# EAGLE schematic Counter2DigitRG (EAGLE 6.4)
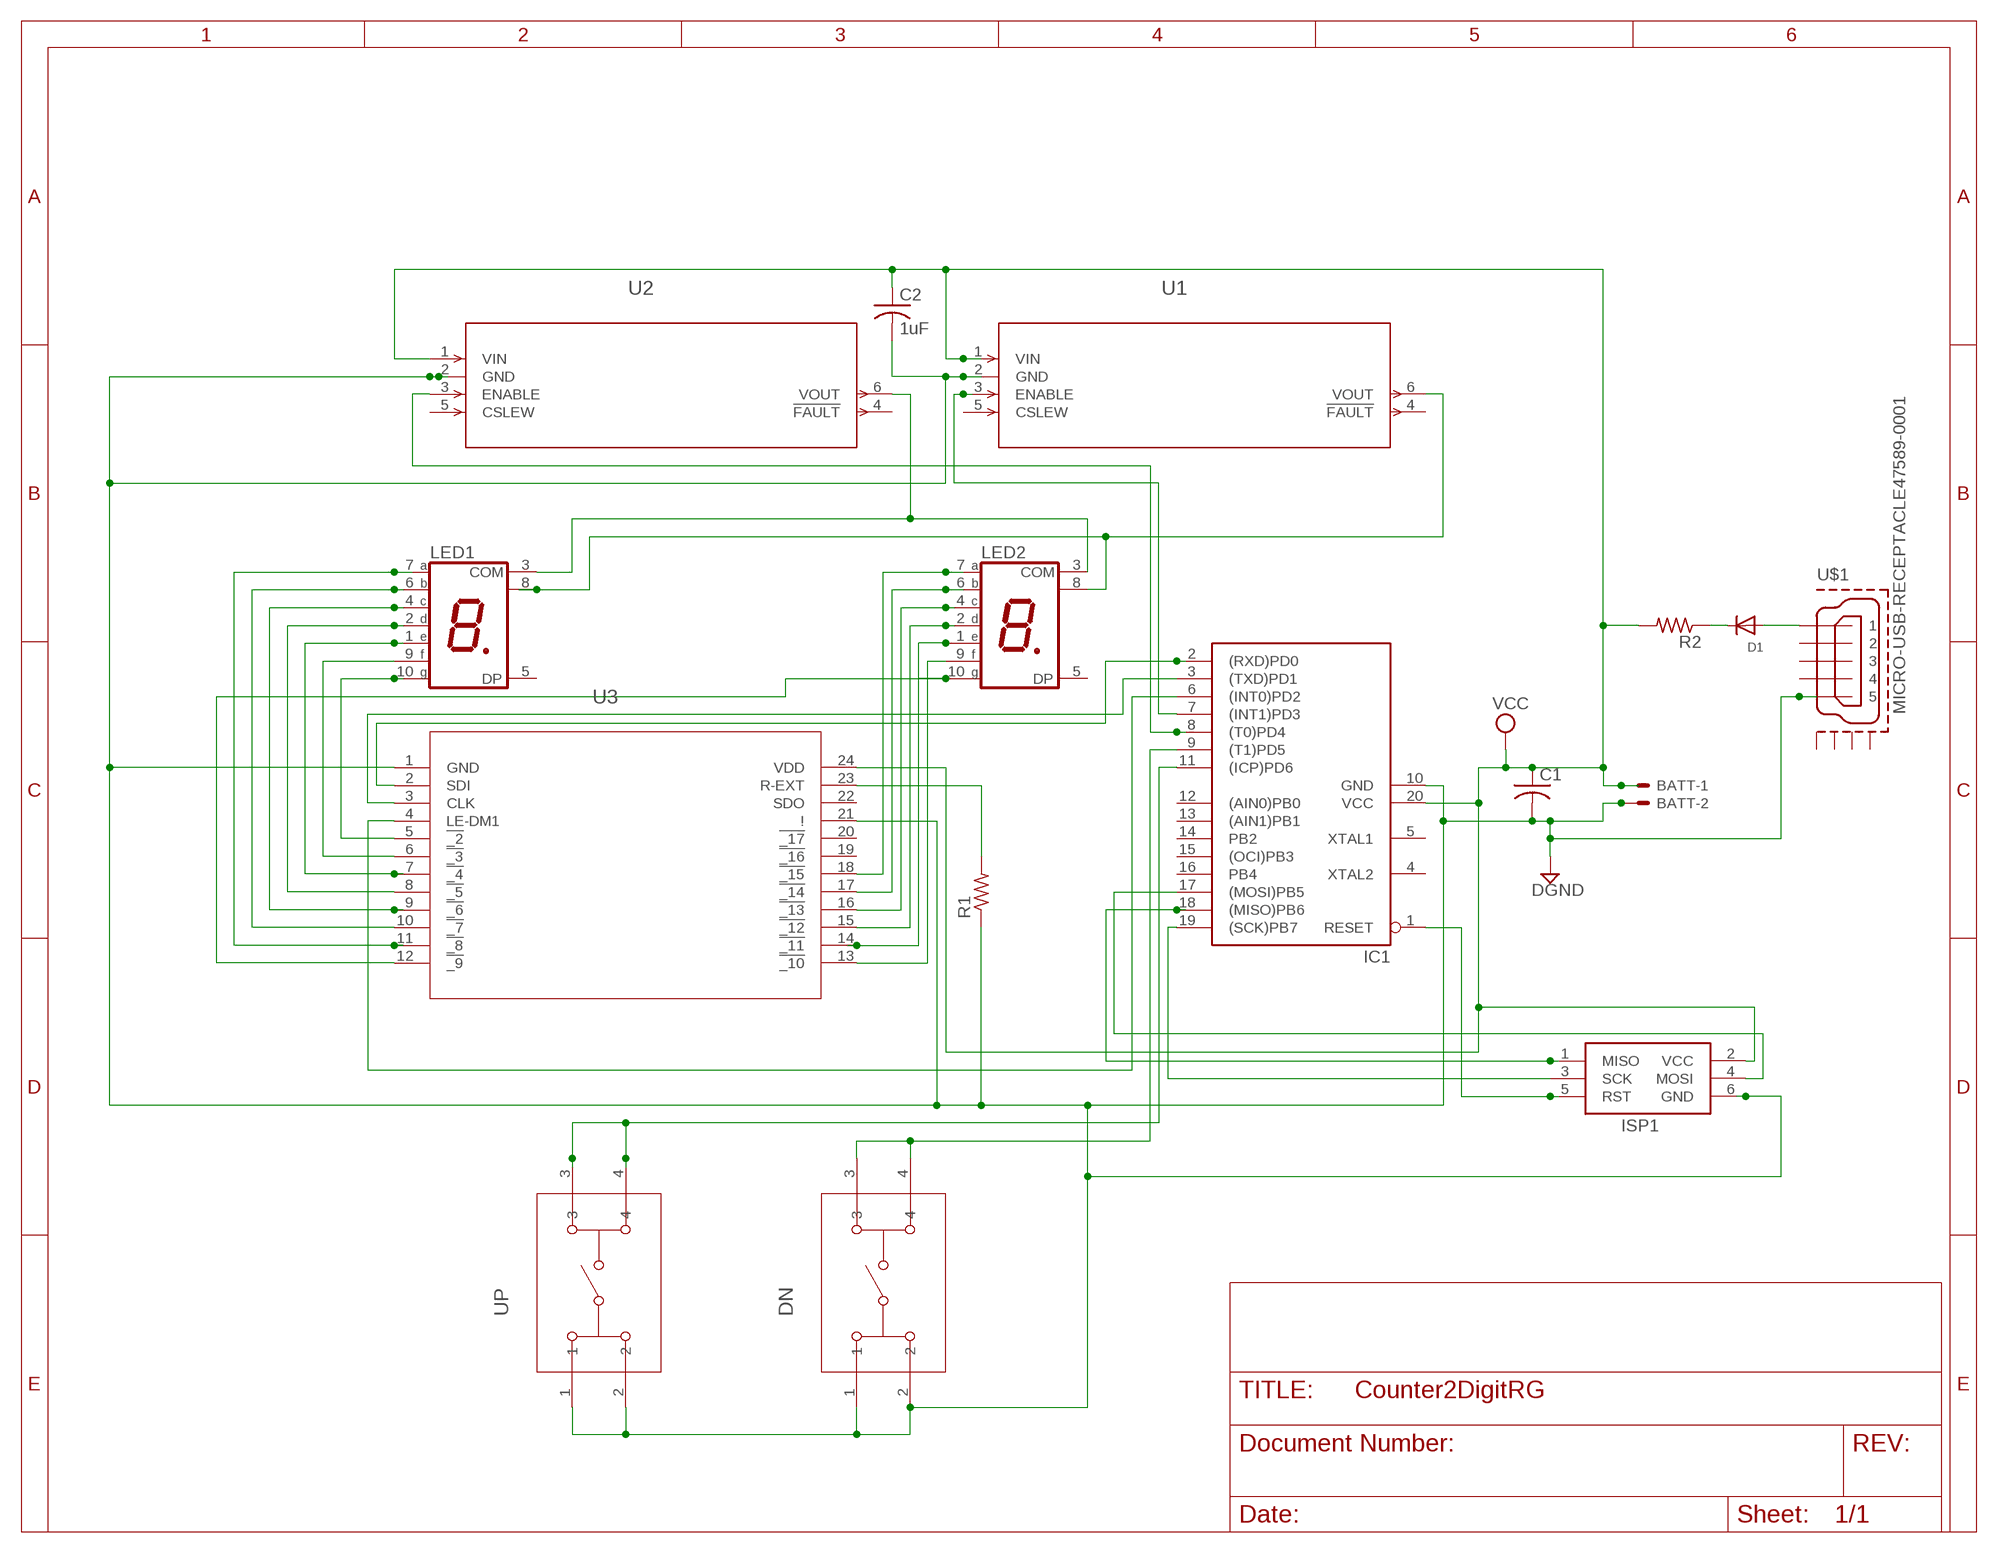
[diagram p0: schematic, sheet 1]

## Parts
BATT  22-23-2021  [22-23-2021]
C1  C-USC0805  [C0805]
C2  1uF  C-USC0805  [C0805]
D1  DIODESOD-123  [SOD-123]
DN  1-1825910-4  [SW4_1825910-D]
IC1  AT90S2313S  [SO20L]
ISP1  AVRISP-6  [AVRISP]
LED1  7-SEG_SA56-11  [SA56-11]
LED2  7-SEG_SA56-11  [SA56-11]
R1  R-US_M0805  [M0805]
R2  R-US_M0805  [M0805]
U1  MIC2005A-2YM6-TR  [SOT-23-6_M6]
U2  MIC2005A-2YM6-TR  [SOT-23-6_M6]
U3  STP16CPC26MTRSO-24-M  [SO-24-M]
U$1  MICRO-USB-RECEPTACLE47589-0001  [47589-0001]
UP  1-1825910-4  [SW4_1825910-D]

## Nets
DGND: BATT.2 C1.2 C2.2 DN.1 DN.2 IC1.10(GND) ISP1.6(GND) R1.1 U1.2(GND) U2.2(GND) U3.1(GND) U3.21(!) U$1.5 UP.1 UP.2
N$1: LED2.2(D) U3.15(!_12)
N$2: LED1.3(COM) LED2.3(COM) U2.6(VOUT)
N$3: IC1.6((INT0)PD2) U3.4(LE-DM1)
N$4: LED1.8(COM) LED2.8(COM) U1.6(VOUT)
N$5: DN.3 DN.4 IC1.9((T1)PD5)
N$6: IC1.11((ICP)PD6) UP.3 UP.4
N$7: R1.2 U3.23(R-EXT)
N$8: IC1.2((RXD)PD0) U3.2(SDI)
N$9: IC1.3((TXD)PD1) U3.3(CLK)
N$10: IC1.18((MISO)PB6) ISP1.1(MISO)
N$11: IC1.7((INT1)PD3) U1.3(ENABLE)
N$12: IC1.8((T0)PD4) U2.3(ENABLE)
N$13: IC1.1(RESET) ISP1.5(RST)
N$14: IC1.19((SCK)PB7) ISP1.3(SCK)
N$15: IC1.17((MOSI)PB5) ISP1.4(MOSI)
N$16: LED2.9(F) U3.13(!_10)
N$17: LED1.10(G) U3.5(!_2)
N$18: LED1.9(F) U3.6(!_3)
N$19: LED1.1(E) U3.7(!_4)
N$20: LED1.2(D) U3.8(!_5)
N$21: LED1.4(C) U3.9(!_6)
N$22: LED1.6(B) U3.10(!_7)
N$23: LED1.7(A) U3.11(!_8)
N$24: LED2.10(G) U3.12(!_9)
N$25: LED2.1(E) U3.14(!_11)
N$26: LED2.4(C) U3.16(!_13)
N$27: LED2.6(B) U3.17(!_14)
N$28: LED2.7(A) U3.18(!_15)
N$29: D1.A U$1.1
N$30: D1.C R2.1
VCC: BATT.1 C1.1 C2.1 IC1.20(VCC) ISP1.2(VCC) R2.2 U1.1(VIN) U2.1(VIN) U3.24(VDD)
Unconnected: IC1.4(XTAL2) IC1.5(XTAL1) IC1.12((AIN0)PB0) IC1.13((AIN1)PB1) IC1.14(PB2) IC1.15((OCI)PB3) IC1.16(PB4) LED1.5(DP) LED2.5(DP) U1.4(!FAULT) U1.5(CSLEW) U2.4(!FAULT) U2.5(CSLEW) U3.19(!_16) U3.20(!_17) U3.22(SDO) U$1.2 U$1.3 U$1.4 U$1.CASING1(GND1) U$1.CASING2(GND2) U$1.CASING3(GND3) U$1.CASING4(GND4)

## Library data of the parts
BATT = con-molex:22-23-2021: .100" (2.54mm) Center Header - 2 Pin; MF: MOLEX; MPN: 22-23-2021; OC_FARNELL: 1462926; OC_NEWARK: 25C3832
C1 C2 = rcl:C-US: CAPACITOR, American symbol
D1 = adafruit:DIODE: Diode SMADIODE - SMA Surface Mount Package 20V 1A Schottky Diode Digikey: 641-1014-6-ND DO-1N4148 - Through Hole Small Current Diode SOD-123 20V 1 A (.5mV Vf) Schottky Diode - Digikey: MBRX120TPMSCT-ND SOD-323 10V 570mA (.38mV Vf, 3ns) Schottky Diode - Digikey: ZLLS410CT-ND SOD-523 30V 30mA Schottky Diode (RB751S-40TE61) - Digikey: RB751S-40TE61CT-ND SOT23-R/W - SOT23 Package (R = Solder Paste/Reflow Ovens, W = Hand-Soldering) BAT54Film 40V 300mA - Digikey: 497-7162-1-ND
DN UP = switch-alcoswitch-pb:1-1825910-4; BUILT_BY: EMA_UL_Team; CONFIGURATION__POLE-THROW_: Single Pole - Single Throw; COPYRIGHT: Copyright (C) 2016 Accelerated Designs. All rights reserved; DESCRIPTION: FSM8JH=6MM TACT SWITCH, HIGH TEMP; MANUFACTURER_PART_NUMBER: 1-1825910-4; MAX_SWITCHING_CURRENT: -; MAX_SWITCHING_VOLTAGE_AC_: -; PRODUCT_TYPE: Switch; SWITCH_TYPE: Tactile Switches; TE_PART_NUMBER: 1-1825910-4; VENDOR: TE Connectivity
IC1 = atmel:AT90S2313: MICROCONTROLLER 2 Kbytes FLASH 128 bytes SRAM 128 bytes EEPROM UART; OC_FARNELL: unknown; OC_NEWARK: unknown
ISP1 = adafruit:AVRISP: AVR ISP HEADER Standard 6 pin header for AVR programming
LED1 LED2 = display-kingbright:7-SEG_: Kingbright 14.2mm (0.56 INCH) SINGLE DIGIT NUMERIC DUISPLAY Source: SA56-11EWA(Ver1189471036.pdf; OC_FARNELL: unknown; OC_NEWARK: unknown
R1 R2 = rcl:R-US_: RESISTOR, American symbol
U1 U2 = MIC2005A:MIC2005A-2YM6-TR; BUILT_BY: EMA_Jessica; COPYRIGHT: Copyright (C) 2018 Accelerated Designs. All rights reserved; MANUFACTURER_PART_NUMBER: MIC2005A-2YM6-TR; VENDOR: Microchip
U3 = STP16CPC26:STP16CPC26MTR; BUILT_BY: EMA_UL_Team; MANUFACTURER_PART_NUMBER: STP16CPC26MTR; VENDOR: STMicroelectronics
U$1 = con-molex-usb:MICRO-USB-RECEPTACLE: MICRO USB RECEPTACLES Micro-USB Receptacles, SMT, Lead-Free from MOLEX <http://www.molex.com/>. (C) 2014 Tomasz Boleslaw CEDRO, cederom@tlen.pl, http://www.tomek.cedro.info. Version 0.1 (2014-01-17): Initial release. Version 0.2 (2014-02-06): Updated 47589-0001 footprint pins/pads/milling. Following devices are included: 1. 47589-0001 Micro-USB AB Receptacle, Bottom Mount, SMT, Lead-Free <http://www.molex.com/molex/products/datasheet.jsp?part=active/0475890001_IO_CONNECTORS.xml> (Technical Drawing <http://www.molex.com/pdm_docs/sd/475890001_sd.pdf>).